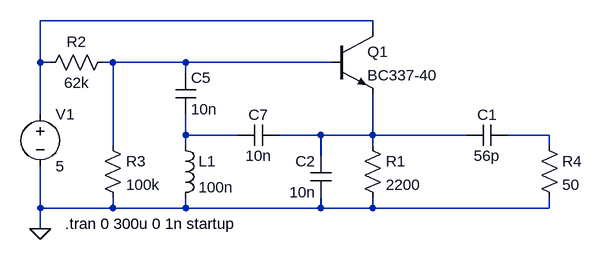
[diagram p0: schematic Kloppits_Collector.asc]
Kloppits_Collector.asc, the LTspice schematic file:
Version 4
SHEET 1 880 776
WIRE -32 336 -544 336
WIRE -32 352 -32 336
WIRE -544 400 -544 336
WIRE -528 400 -544 400
WIRE -432 400 -448 400
WIRE -320 400 -432 400
WIRE -96 400 -320 400
WIRE -320 416 -320 400
WIRE -544 480 -544 400
WIRE -320 512 -320 480
WIRE -240 512 -320 512
WIRE -112 512 -176 512
WIRE -32 512 -32 448
WIRE -32 512 -112 512
WIRE 112 512 -32 512
WIRE 240 512 176 512
WIRE -432 528 -432 400
WIRE -320 528 -320 512
WIRE -32 528 -32 512
WIRE 240 528 240 512
WIRE -112 544 -112 512
WIRE -544 624 -544 560
WIRE -432 624 -432 608
WIRE -432 624 -544 624
WIRE -320 624 -320 608
WIRE -320 624 -432 624
WIRE -112 624 -112 608
WIRE -112 624 -320 624
WIRE -32 624 -32 608
WIRE -32 624 -112 624
WIRE 240 624 240 608
WIRE 240 624 -32 624
WIRE -544 656 -544 624
FLAG -544 656 0
SYMBOL ind -336 512 R0
SYMATTR InstName L1
SYMATTR Value 100n
SYMBOL cap -96 608 R180
WINDOW 0 24 56 Left 2
WINDOW 3 24 8 Left 2
SYMATTR InstName C2
SYMATTR Value 10n
SYMBOL cap -336 416 R0
SYMATTR InstName C5
SYMATTR Value 10n
SYMBOL cap -240 528 R270
WINDOW 0 32 32 VTop 2
WINDOW 3 0 32 VBottom 2
SYMATTR InstName C7
SYMATTR Value 10n
SYMBOL res -48 512 R0
SYMATTR InstName R1
SYMATTR Value 2200
SYMBOL res -432 384 R90
WINDOW 0 0 56 VBottom 2
WINDOW 3 32 56 VTop 2
SYMATTR InstName R2
SYMATTR Value 62k
SYMBOL res -448 512 R0
SYMATTR InstName R3
SYMATTR Value 100k
SYMBOL npn -96 352 R0
SYMATTR InstName Q1
SYMATTR Value BC337-40
SYMBOL voltage -544 464 R0
WINDOW 123 0 0 Left 2
WINDOW 39 0 0 Left 2
SYMATTR InstName V1
SYMATTR Value 5
SYMBOL cap 176 496 R90
WINDOW 0 0 32 VBottom 2
WINDOW 3 32 32 VTop 2
SYMATTR InstName C1
SYMATTR Value 56p
SYMBOL res 224 512 R0
SYMATTR InstName R4
SYMATTR Value 50
TEXT -506 648 Left 2 !.tran 0 300u 0 1n startup

The netlist it stands for:
* Kloppits_Collector.asc
L1 N003 0 100n
C2 0 N004 10n
C5 N002 N003 10n
C7 N003 N004 10n
R1 N004 0 2200
R2 N002 N001 62k
R3 N002 0 100k
Q1 N001 N002 N004 0 BC337-40
V1 N001 0 5
C1 N005 N004 56p
R4 N005 0 50
.model NPN NPN
.model PNP PNP
.lib standard.bjt
.tran 0 300u 0 1n startup
.backanno
.end